# Altium schematic sheet Input protect.SchDoc
size A4
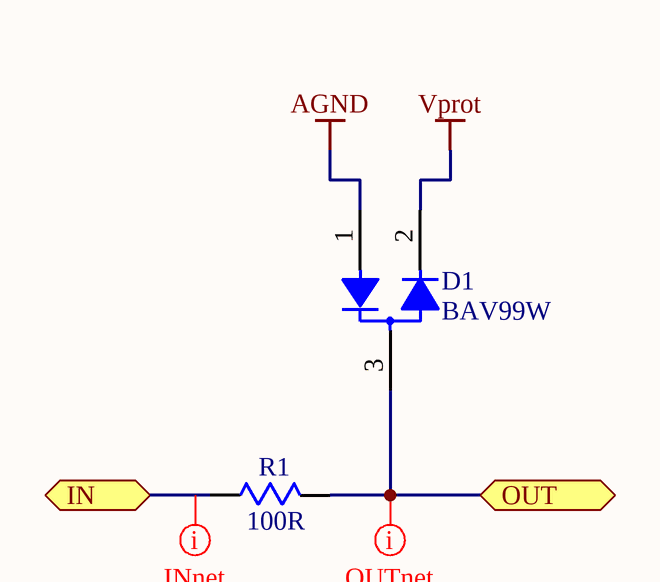
[diagram p0: Input protect.SchDoc]

## Parts
D1  BAV99W  [SMD/SOT323]
R1  100R  [SMD/R/0805]

## Ports
IN, OUT

## Nets
AGND: D1.1
Vprot: D1.2
IN: R1.1 ; port IN
OUT: D1.3 R1.2 ; port OUT

## Layout directives
net class INnet: IN
net class OUTnet: OUT

## Library data of the parts
D1 = BAV99: Value: BAV99W
R1 = Resistor: Value: 100R